# EAGLE design CCupPSU (EAGLE 6.5.0)
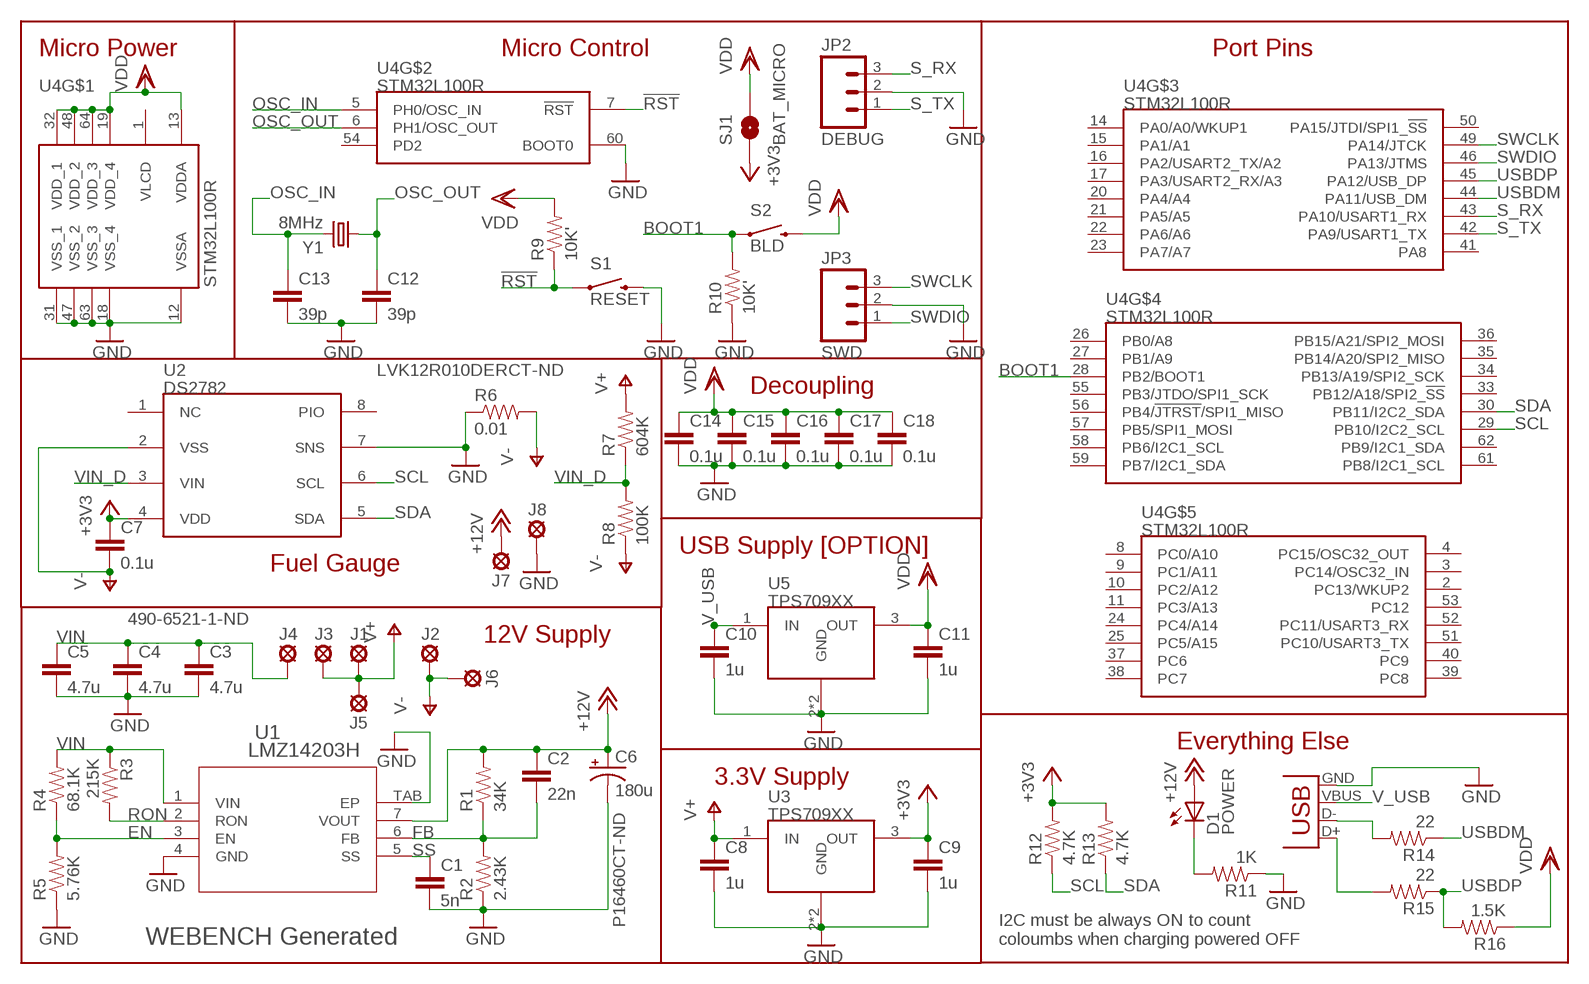
[diagram p0: schematic, sheet 1]

## Parts
C1  5n  CAP1206  [1206]
C2  22n  CAP1206  [1206]
C3  4.7u  CAP1206  [1206]
C4  4.7u  CAP1206  [1206]
C5  4.7u  CAP1206  [1206]
C6  180u  CAP_POLE  [PANASONIC_E]
C7  0.1u  CAP1206  [1206]
C8  1u  CAP1206  [1206]
C9  1u  CAP1206  [1206]
C10  1u  CAP1206  [1206]
C11  1u  CAP1206  [1206]
C12  39p  CAP1206  [1206]
C13  39p  CAP1206  [1206]
C14  0.1u  CAP1206  [1206]
C15  0.1u  CAP1206  [1206]
C16  0.1u  CAP1206  [1206]
C17  0.1u  CAP1206  [1206]
C18  0.1u  CAP1206  [1206]
D1  POWER  LED-RED1206  [LED-1206]
J1  SE14  [SE14]
J2  SE14  [SE14]
J3  SE14  [SE14]
J4  SE14  [SE14]
J5  SE14  [SE14]
J6  SE14  [SE14]
J7  SE14  [SE14]
J8  SE14  [SE14]
JP1  USBSMD  [USB-MINIB]
JP2  DEBUG  M03PTH  [1X03]
JP3  SWD  M03PTH  [1X03]
R1  34K  RESISTOR1206  [1206]
R2  2.43K  RESISTOR1206  [1206]
R3  215K  RESISTOR1206  [1206]
R4  68.1K  RESISTOR1206  [1206]
R5  5.76K  RESISTOR1206  [1206]
R6  0.01  RESISTOR1206  [1206]
R7  604K  RESISTOR1206  [1206]
R8  100K  RESISTOR1206  [1206]
R9  10K'  RESISTOR1206  [1206]
R10  10K'  RESISTOR1206  [1206]
R11  1K  RESISTOR1206  [1206]
R12  4.7K  RESISTOR1206  [1206]
R13  4.7K  RESISTOR1206  [1206]
R14  22  RES1206  [1206]
R15  22  RES1206  [1206]
R16  1.5K  RES1206  [1206]
S1  RESET  SWITCH-MOMENTARY-2PTH  [TACTILE-PTH]
S2  BLD  SWITCH-MOMENTARY-2PTH  [TACTILE-PTH]
SJ1  BAT_MICRO  SOLDERJUMPERTRACE  [SJ_2S-TRACE]
U1  LMZ14203H  [TZA07A]
U2  DS2782  [TSSOP8]
U3  TPS709XX  [SOT223]
U4  STM32L100R  [TQFP64]
U5  TPS709XX  [SOT223]
Y1  8MHz  CRYSTALHC49US  [HC49US]

## Nets
!RST!: R9.1 S1.1 U4.7(!RST!)
+3V3: C7.1 C9.1 R12.2 R13.2 SJ1.1 U2.4(VDD) U3.3(OUT)
+12V: C2.1 C6.+ D1.A J7.MP R1.2 U1.7(VOUT)
BOOT1: R10.2 S2.1 U4.28(PB2/BOOT1)
EN: R4.1 R5.2 U1.3(EN)
FB: C2.2 R1.1 R2.2 U1.6(FB)
GND: C1.2 C3.2 C4.2 C5.2 C6.- C8.2 C9.2 C10.2 C11.2 C12.2 C13.2 C14.2 C15.2 C16.2 C17.2 C18.2 J8.MP JP1.GND JP2.2 JP3.2 R2.1 R5.1 R6.1 R10.1 R11.1 S1.3 U1.4(GND) U1.TAB(EP) U2.7(SNS) U3.2(GND) U3.4(GND) U4.12(VSSA) U4.18(VSS_4) U4.31(VSS_1) U4.47(VSS_2) U4.60(BOOT0) U4.63(VSS_3) U5.2(GND) U5.4(GND)
OSC_IN: C13.1 U4.5(PH0/OSC_IN) Y1.2
OSC_OUT: C12.1 U4.6(PH1/OSC_OUT) Y1.1
PLED: D1.C R11.2
RON: R3.2 U1.2(RON)
S_RX: JP2.3 U4.43(PA10/USART1_RX)
S_TX: JP2.1 U4.42(PA9/USART1_TX)
SCL: R12.1 U2.6(SCL) U4.29(PB10/I2C2_SCL)
SDA: R13.1 U2.5(SDA) U4.30(PB11/I2C2_SDA)
SS: C1.1 U1.5(SS)
SWCLK: JP3.3 U4.49(PA14/JTCK)
SWDIO: JP3.1 U4.46(PA13/JTMS)
USB_D+: JP1.D+ R15.2
USB_D-: JP1.D- R14.2
USBDM: R14.1 U4.44(PA11/USB_DM)
USBDP: R15.1 R16.2 U4.45(PA12/USB_DP)
V+: C8.1 J1.MP J3.MP J5.MP R7.2 U3.1(IN)
V-: C7.2 J2.MP J6.MP R6.2 R8.1 U2.2(VSS)
V_USB: C10.1 JP1.VBUS U5.1(IN)
VDD: C11.1 C14.1 C15.1 C16.1 C17.1 C18.1 R9.2 R16.1 S2.3 SJ1.2 U4.13(VDDA) U4.19(VDD_4) U4.32(VDD_1) U4.48(VDD_2) U4.64(VDD_3) U5.3(OUT)
VIN: C3.1 C4.1 C5.1 J4.MP R3.1 R4.2 U1.1(VIN)
VIN_D: R7.1 R8.2 U2.3(VIN)
Unconnected: U2.1(NC) U2.8(PIO) U4.1(VLCD) U4.2(PC13/WKUP2) U4.3(PC14/OSC32_IN) U4.4(PC15/OSC32_OUT) U4.8(PC0/A10) U4.9(PC1/A11) U4.10(PC2/A12) U4.11(PC3/A13) U4.14(PA0/A0/WKUP1) U4.15(PA1/A1) U4.16(PA2/USART2_TX/A2) U4.17(PA3/USART2_RX/A3) U4.20(PA4/A4) U4.21(PA5/A5) U4.22(PA6/A6) U4.23(PA7/A7) U4.24(PC4/A14) U4.25(PC5/A15) U4.26(PB0/A8) U4.27(PB1/A9) U4.33(PB12/A18/SPI2_!SS!) U4.34(PB13/A19/SPI2_SCK) U4.35(PB14/A20/SPI2_MISO) U4.36(PB15/A21/SPI2_MOSI) U4.37(PC6) U4.38(PC7) U4.39(PC8) U4.40(PC9) U4.41(PA8) U4.50(PA15/JTDI/SPI1_!SS!) U4.51(PC10/USART3_TX) U4.52(PC11/USART3_RX) U4.53(PC12) U4.54(PD2) U4.55(PB3/JTDO/SPI1_SCK) U4.56(PB4/!JTRST!/SPI1_MISO) U4.57(PB5/SPI1_MOSI) U4.58(PB6/I2C1_SCL) U4.59(PB7/I2C1_SDA) U4.61(PB8/I2C1_SCL) U4.62(PB9/I2C1_SDA)

## Notes on the sheet
- Micro Power | Micro Control | Port Pins
- LVK12R010DERCT-ND
- Decoupling
- USB Supply [OPTION]
- Fuel Gauge
- 490-6521-1-ND
- 12V Supply
- Everything Else
- 3.3V Supply
- P16460CT-ND
- WEBENCH Generated
- I2C must be always ON to count
  coloumbs when charging powered OFF

## Library data of the parts
C1-C5 C7-C18 = SparkFun-Passives:CAP: Capacitor Standard 0603 ceramic capacitor, and 0.1" leaded capacitor.
C6 = SparkFun-Passives:CAP_POL: Capacitor Polarized These are standard SMD and PTH capacitors. Normally 10uF, 47uF, and 100uF in electrolytic and tantalum varieties. Always verify the external diameter of the through hole cap, it varies with capacity, voltage, and manufacturer. The EIA devices should be standard.
D1 = SparkFun-LED:LED-RED: Assorted Red LEDs LilyPad 1206- DIO-09912 1206- DIO-00809 0603- DIO-00819; PROD_ID: DIO-00809; VALUE: RED
J1-J8 = solpad:SE14: SOLDER PAD E1553, drill 1,4mm, distributor Buerklin, 07F820
JP1 = SparkFun-Connectors:USB: USB Connectors USB-B-PTH is fully proven SKU : PRT-00139/CONN-08278 USB-miniB is fully proven SKU : PRT-00587 USB-A-PCB is untested. USB-A-H is throughly reviewed, but untested. Spark Fun Electronics SKU : PRT-00437 USB-B-SMT is throughly reviewed, but untested. Needs silkscreen touching up. USB-A-S has not been used/tested USB-MB-H has not been used/tested USB-MICROB has been used. CONN-09505
JP2 JP3 = SparkFun-Connectors:M03: Header 3 Standard 3-pin 0.1" header. Use with straight break away headers (SKU : PRT-00116), right angle break away headers (PRT-00553), swiss pins (PRT-00743), machine pins (PRT-00117), and female headers (PRT-00115). Molex polarized connector foot print use with SKU : PRT-08232 with associated crimp pins and housings.
R1-R13 = SparkFun-Passives:RESISTOR: Resistor Basic schematic elements and footprints for 0603, 1206, and PTH resistors.
R14-R16 = ECE477:RES: RESISTOR Surface-mount resistors
S1 S2 = SparkFun-Electromechanical:SWITCH-MOMENTARY-2: Various NO switches- pushbuttons, reed, etc
SJ1 = SparkFun-Passives:SOLDERJUMPER: Solder Jumper Standard SMD solder jumper. Used to automate production. Two varients : Normally Open and Normally Closed are the same, but have different paste layers. NC will have a large amount of paste and should jumper during reflow.
U1 = CCupPSU:LMZ14203H: LMZ14203H 3A SIMPLE SWITCHER® Power Module with 42V Maximum Input; BASEPN: LMZ14203; DATASHEETURL: http://www.ti.com/lit/ds/symlink/lmz14203h.pdf; DESCRIPTION: 3A SIMPLE SWITCHER® Power Module with 42V Maximum Input; MANUFACTURER: Texas Instruments; MANUFACTURER_PART_NUMBER: lmz14203h_ndw_7; NSC_PACKAGEREFERENCE: TZA07A; VENDOR: Texas Instruments
U2 = LMZ14203H:DS2782: DS2782 Stand-Alone Fuel Gauge IC
U3 U5 = CCupPSU:TPS709XX: TPS709XX 150-mA, 30-V, Ultra-Low IQ, Wide Input Low-Dropout Regulator with Reverse Current Protection
U4 = CCupPSU:STM32L100R: STM32L100XX Ultra-low-power 32-bit Value Line ARM Cortex-M3 MCU with 32 Kbytes Flash, 32 MHz CPU, LCD, USB
Y1 = SparkFun-FreqCtrl:CRYSTAL: Various standard crystals. Proven footprints. Spark Fun Electronics SKU : COM-00534

## Board
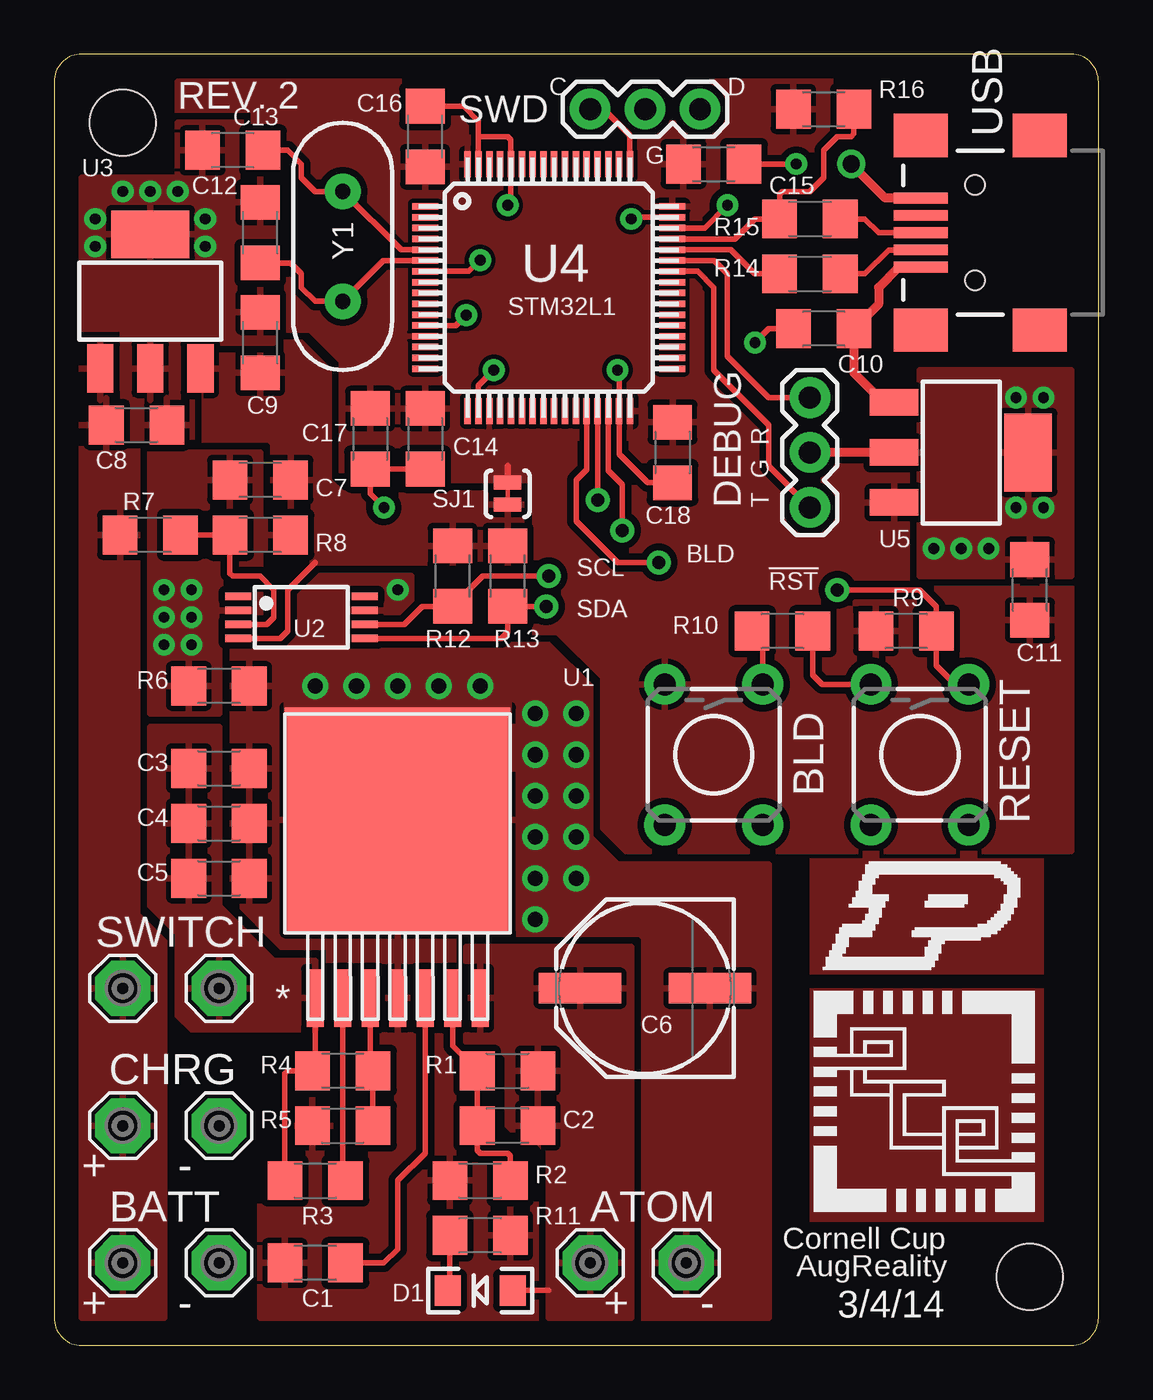
[diagram p1: board, top side]
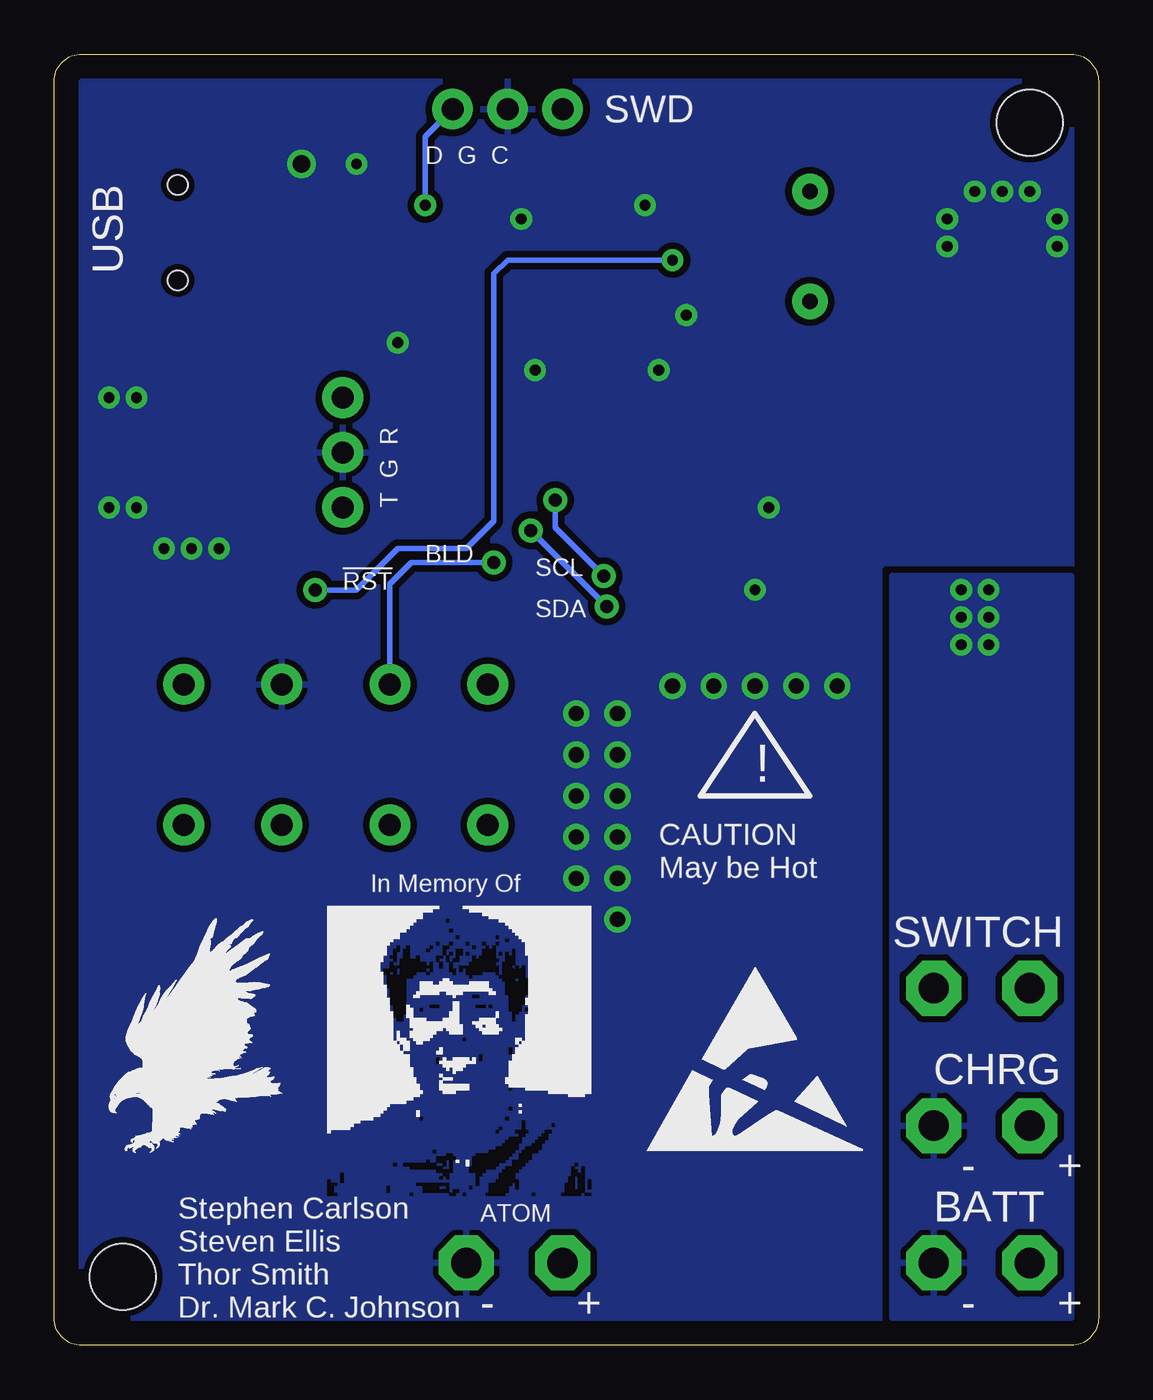
[diagram p2: board, bottom side, seen from below]

Size 48.26 x 59.69 mm. Coordinates in mm from the lower left corner, seen from the top.
Outline: 0,58.42 0,1.27 arc90 1.27,0 46.99,0 arc90 48.26,1.27 48.26,58.42 arc90 46.99,59.69 1.27,59.69 arc90 0,58.42
Copper layers (1*16): Top 0.035mm / dielectric 1.5mm / Bottom 0.035mm
Design rules "SparkFun *": minimum track width 8mil, minimum drill 13mil, track to track 8mil, track to pad 8mil, pad to pad 8mil, via to via 8mil, smd to smd 8mil, copper to edge 10mil, drill to drill 8mil, minimum pad ring 12mil, minimum via ring 10mil, stop-mask expansion 4mil, vias tented up to drill 25mil, thermal gap 10mil
Holes 3.05 mm at 45.09,3.17 3.17,56.52
bRestrict: area 35.2,6.9 to 35.6,7.1; area 31.7,6.9 to 31.8,7.1; area 29.7,6.9 to 30,7.1; area 29.2,6.9 to 29.4,7.1; area 27.4,6.9 to 28.3,7.1; area 26,6.9 to 26.2,7.1; area 23.9,6.9 to 24.8,7.1; area 23.4,6.9 to 23.7,7.1; area 35.3,7.1 to 35.6,7.2; area 32.7,7.1 to 32.9,7.2; area 30,7.1 to 31.2,7.2; area 29.5,7.1 to 29.8,7.2; 215 more areas

### Footprints (pad centres in the part's own frame; a part is rotated, then mirrored left to right if it is on the bottom)
1206 = smd 1.6 x 1.8: 1 -1.4,0; 2 1.4,0
PANASONIC_E = smd 3.8 x 1.4: + 3,0; - -3,0
LED-1206 = smd 1.2 x 1.4: A -1.5,0; C 1.5,0
SE14 = drill 1.397 pad 2.54 octagon: MP 0,0
USB-MINIB = smd 2.5 x 0.5: D+ 2.5,0; D- 2.5,0.8; GND 2.5,-1.6; ID 2.5,-0.8; VBUS 2.5,1.6 | smd 2.5 x 2: MTN1 -3,4.5; MTN2 2.5,4.5; MTN3 -3,-4.5; MTN4 2.5,-4.5 | hole 0.9: 0,2.2; 0,-2.2
1X03 = drill 1.016 pad 1.88: 1 0,0; 2 2.54,0; 3 5.08,0
TACTILE-PTH = drill 1.016 pad 1.88: 1 -3.251,2.261; 2 3.251,2.261; 3 -3.251,-2.261; 4 3.251,-2.261
SJ_2S-TRACE = smd 0.635 x 1.27: 1 -0.508,0; 2 0.508,0
TZA07A = smd 0.787 x 2.667: 1 -3.81,-8.077; 2 -2.54,-8.077; 3 -1.27,-8.077; 4 0,-8.077; 5 1.27,-8.077; 6 2.54,-8.077; 7 3.81,-8.077 | smd 10.414 x 10.414: TAB 0,0.152
TSSOP8 = smd 1.2 x 0.35: 1 -2.925,0.975; 2 -2.925,0.325; 3 -2.925,-0.325; 4 -2.925,-0.975; 5 2.925,-0.975; 6 2.925,-0.325; 7 2.925,0.325; 8 2.925,0.975
SOT223 = smd 1.219 x 2.235: 1 -2.311,-3.099; 2 0,-3.099; 3 2.311,-3.099 | smd 3.6 x 2.2: 4 0,3.099
TQFP64 = smd 1.2 x 0.3: 1 -5.7,3.75; 2 -5.7,3.25; 3 -5.7,2.75; 4 -5.7,2.25; 5 -5.7,1.75; 6 -5.7,1.25; 7 -5.7,0.75; 8 -5.7,0.25; 9 -5.7,-0.25; 10 -5.7,-0.75; 11 -5.7,-1.25; 12 -5.7,-1.75; 13 -5.7,-2.25; 14 -5.7,-2.75; 15 -5.7,-3.25; 16 -5.7,-3.75; 33 5.7,-3.75; 34 5.7,-3.25; 35 5.7,-2.75; 36 5.7,-2.25; 37 5.7,-1.75; 38 5.7,-1.25; 39 5.7,-0.75; 40 5.7,-0.25; 41 5.7,0.25; 42 5.7,0.75; 43 5.7,1.25; 44 5.7,1.75; 45 5.7,2.25; 46 5.7,2.75; 47 5.7,3.25; 48 5.7,3.75 | smd 0.3 x 1.2: 17 -3.75,-5.7; 18 -3.25,-5.7; 19 -2.75,-5.7; 20 -2.25,-5.7; 21 -1.75,-5.7; 22 -1.25,-5.7; 23 -0.75,-5.7; 24 -0.25,-5.7; 25 0.25,-5.7; 26 0.75,-5.7; 27 1.25,-5.7; 28 1.75,-5.7; 29 2.25,-5.7; 30 2.75,-5.7; 31 3.25,-5.7; 32 3.75,-5.7; 49 3.75,5.7; 50 3.25,5.7; 51 2.75,5.7; 52 2.25,5.7; 53 1.75,5.7; 54 1.25,5.7; 55 0.75,5.7; 56 0.25,5.7; 57 -0.25,5.7; 58 -0.75,5.7; 59 -1.25,5.7; 60 -1.75,5.7; 61 -2.25,5.7; 62 -2.75,5.7; 63 -3.25,5.7; 64 -3.75,5.7
HC49US = drill 0.7 pad 1.651: 1 -2.54,0; 2 2.54,0

### Placement (x,y rotation side)
C1  12.06,3.81 180 top
C2  20.95,10.16 180 top
C3  7.62,26.67 0 top
C4  7.62,24.13 0 top
C5  7.62,21.59 0 top
C6  27.3,16.51 180 top
C7  9.53,40.01 180 top
C8  3.81,42.55 0 top
C9  9.53,46.35 90 top
C10  35.56,46.99 180 top
C11  45.09,34.92 90 top
C12  9.53,51.44 90 top
C13  8.26,55.24 180 top
C14  17.14,41.91 270 top
C15  30.48,54.61 0 top
C16  17.14,55.88 90 top
C17  14.61,41.91 270 top
C18  28.57,41.27 270 top
D1  19.68,2.54 180 top
J1  3.17,3.81 0 top
J2  7.62,3.81 0 top
J3  3.17,16.51 0 top
J4  7.62,16.51 0 top
J5  3.17,10.16 0 top
J6  7.62,10.16 0 top
J7  24.77,3.81 0 top
J8  29.21,3.81 0 top
JP1  42.55,51.44 180 top
JP2  34.92,38.73 90 top
JP3  29.84,57.15 180 top
R1  20.95,12.7 0 top
R2  19.68,7.62 0 top
R3  12.06,7.62 0 top
R4  13.34,12.7 180 top
R5  13.34,10.16 0 top
R6  7.62,30.48 180 top
R7  4.45,37.47 180 top
R8  9.53,37.47 180 top
R9  39.37,33.02 180 top
R10  33.66,33.02 180 top
R11  19.68,5.08 180 top
R12  18.41,35.56 90 top
R13  20.95,35.56 90 top
R14  34.92,49.53 0 top
R15  34.92,52.07 0 top
R16  35.56,57.15 0 top
S1  40.01,27.3 270 top
S2  30.48,27.3 270 top
SJ1  20.95,39.37 90 top
U1  15.88,24.13 0 top
U2  11.43,33.66 0 top
U3  4.45,48.26 0 top
U4  22.86,48.9 0 top
U5  41.91,41.27 270 top
U$1  [ESD_10.00]  20.95,8.89 0 bottom
U$2  [EAGLE-PLC-8MM]  45.72,8.89 0 bottom
Y1  13.34,50.8 90 top

### Tracks (layer width: path | path; a pad name or v marks a point on that pad's centre or on a via)
!RST!  (via drill 0.5, 0.6)
  Top 0.254: U4.7 19.16,49.65 v19.68,50.16 | v36.2,34.92 40.01,34.92 40.77,34.16 R9.1 40.77,31.42 41.63,30.56 S1.1
  Bottom 0.254: v19.68,50.16 27.3,50.16 27.94,49.53 27.94,38.1 29.21,36.83 32.38,36.83 34.29,34.92 v36.2,34.92
+3V3
  Top 0.254: U2.4 10.46,32.68 10.79,33.02 10.79,34.92 12.06,36.2
  pour Top (isolate 0.305, rank 2): 6.35,46.35 6.35,41.27 9.53,41.27 9.53,36.83 10.16,36.2 21.59,36.2 21.59,39.37 13.34,39.37 12.7,40.01 12.7,45.09 11.43,46.35
+12V
  Top 0.254: D1.A 22.86,2.54
  pour Top (isolate 0.305): 19.05,13.97 20.32,13.97 20.95,13.34 20.95,10.16 21.59,9.53 22.23,9.53 22.86,8.89 22.86,1.27 26.67,1.27 26.67,18.41 19.05,18.41
BOOT1  (via drill 0.6)
  Top 0.254: S2.1 32.74,32.53 R10.2 | U4.28 24.61,40.48 24.13,40.01 24.13,38.1 26.04,36.2 v27.94,36.2
  Bottom 0.254: v27.94,36.2 31.75,36.2 32.74,35.2 S2.1
EN
  Top 0.254: U1.3 14.61,12.83 R4.1 R5.2
FB
  Top 0.254: R2.2 21.09,8.76 20.95,8.89 19.68,8.89 19.55,9.02 C2.2 R1.1 18.41,13.84 U1.6
  Top 0.305: 19.68,12.83 R1.1
GND  (via drill 0.5, 0.7, 0.8)
  Top 0.254: C14.2 C17.2 14.61,39.37 v15.24,38.73 | R10.1 35.05,30.98 35.48,30.56 S1.3 | U4.63 19.61,55.88 | 19.61,55.88 19.61,56.59 18.92,57.28 C16.2 | 19.61,55.88 20.95,55.88 21.11,55.73 U4.60 21.11,52.86 v20.95,52.7 | U4.12 18.57,47.15 v19.05,47.62 | U4.18 19.61,44.38 v20.32,45.09 | U4.47 26.75,52.15 v26.67,52.07 | C18.2 27.43,39.88 26.11,41.2 U4.31 26.11,45.01 v26.04,45.09 | C10.2 33.02,46.99 v32.38,46.35 | C15.2 v34.29,54.61
  Top 0.406: JP1.GND 38.41,53.03 v36.83,54.61 | U5.2 JP2.2
  other vias: 12.06,30.48 13.97,30.48 15.88,30.48 17.78,30.48 19.68,30.48 22.23,23.5 22.23,21.59 24.13,23.5 22.23,19.68 24.13,25.4 24.13,29.21 22.23,25.4 22.23,27.3 22.23,29.21 24.13,27.3 24.13,21.59 1.91,50.8 6.99,50.8 6.99,52.07 1.91,52.07 3.17,53.34 4.45,53.34 5.71,53.34 15.88,34.92 44.45,38.73 45.72,38.73 44.45,43.81 45.72,43.81 40.64,36.83 41.91,36.83 43.18,36.83
  pour Bottom (isolate 0.305, rank 3): 1.27,58.42 1.27,1.27 46.99,1.27 46.99,58.42
  pour Top (isolate 0.305, rank 3): 8.26,32.38 8.26,20.32 10.16,18.41 12.7,18.41 12.7,13.97 9.53,13.97 9.53,1.27 33.02,1.27 33.02,22.23 26.04,22.23 24.77,23.5 24.77,30.48 22.86,32.38 16.51,32.38 16.51,35.56 10.79,35.56 10.79,33.02 10.16,32.38
  pour Top (isolate 0.305, no thermals): 21.59,26.67 10.79,26.67 10.79,28.57 21.59,28.57
  pour Top (isolate 0.305): 1.27,53.98 1.27,46.99 3.17,46.99 3.17,41.91 6.35,41.91 6.35,46.35 10.16,46.35 10.16,56.52 5.71,56.52 5.71,53.98
  pour Top (isolate 0.305, no thermals): 10.79,30.48 10.79,29.21 20.95,29.21 20.95,30.48
  pour Top (isolate 0.305, rank 3): 40.01,45.09 40.01,35.56 46.99,35.56 46.99,45.09
  pour Bottom (no thermals): 22.86,20.32 22.86,6.35 36.2,6.35 36.2,20.32
  pour Top (rank 5, no thermals): 34.92,22.86 34.92,17.14 45.72,17.14 45.72,22.86
  pour Top (rank 5, no thermals): 34.92,16.51 34.92,5.71 45.72,5.71 45.72,16.51
OSC_IN
  Top 0.254: U4.5 16.03,50.65 Y1.2 12.06,53.34 11.43,53.98 11.43,54.61 10.79,55.24 C13.1
OSC_OUT
  Top 0.254: U4.6 15.22,50.15 Y1.1 12.06,48.26 11.43,48.9 11.43,49.53 10.93,50.03 C12.1
PLED
  Top 0.254: R11.2 18.29,2.64
  Top 0.305: 18.29,2.64 D1.C
RON
  Top 0.254: U1.2 13.34,7.75 R3.2
S_RX
  Top 0.254: U4.43 30.5,50.15 31.11,49.53 31.11,45.72 33.02,43.81 JP2.3
S_TX
  Top 0.254: U4.42 29.73,49.65 30.48,48.9 30.48,45.09 33.02,42.55 33.02,40.64 JP2.1
SCL  (via drill 0.6)
  Top 0.254: U2.6 16.18,33.33 17.02,34.16 R12.1 19.82,35.56 v22.86,35.56 | U4.29 v25.11,39.08
  Bottom 0.254: v25.11,39.08 25.11,37.81 v22.86,35.56
SDA  (via drill 0.6)
  Top 0.254: U2.5 20.66,32.68 20.95,32.98 R13.1 v22.73,34.16 | v26.25,37.67 26.25,39.8 25.61,40.43 U4.30
  Bottom 0.254: v22.73,34.16 v26.25,37.67
SS
  Top 0.254: U1.5 17.14,8.89 15.88,7.62 15.88,4.45 15.24,3.81 C1.1
SWCLK
  Top 0.254: U4.49 26.61,55.94 25.4,57.15 JP3.3
SWDIO  (via drill 0.5)
  Top 0.254: U4.46 30.05,51.65 v31.11,52.7
  Bottom 0.254: v31.11,52.7 31.11,55.88 JP3.1
USB_D+
  Top 0.254: JP1.D+ 38.1,51.44 37.47,52.07 R15.2
USB_D-
  Top 0.254: R14.2 37.47,49.53 38.57,50.63 JP1.D-
USBDM
  Top 0.254: U4.44 31.27,50.65 32.38,49.53 R14.1
USBDP
  Top 0.254: U4.45 31.46,51.15 32.38,52.07 R15.1 33.52,53.21 33.66,53.34 34.92,53.34 35.56,53.98 35.56,55.24 36.2,55.88 36.83,55.88 36.96,56.01 R16.2
V+
  pour Top (isolate 0.305, rank 2): 1.27,1.27 5.08,1.27 5.08,19.05 4.45,19.68 4.45,46.35 1.27,46.35
V-  (via drill 0.5)
  other vias: 6.35,33.66 5.08,32.38 6.35,32.38 5.08,33.66 5.08,34.92 6.35,34.92
  pour Bottom (isolate 0.305): 1.27,35.56 1.27,1.27 9.53,1.27 9.53,35.56
  pour Top (isolate 0.305): 4.45,41.27 4.45,29.21 7.62,29.21 7.62,33.02 8.89,33.02 9.53,33.66 9.53,36.83 11.43,36.83 11.43,38.1 9.53,38.1 9.53,41.27
V_USB
  Top 0.406: U5.1 38.33,43.59 36.96,44.95 C10.1 38.1,48.13 38.1,48.9 39.04,49.84 JP1.VBUS
VDD
  Top 0.305: SJ1.2 20.95,40.64
  pour Top (isolate 0.305, rank 4): 5.71,58.42 5.71,54.61 8.89,54.61 8.89,40.01 22.23,40.01 22.23,22.86 46.99,22.86 46.99,58.42
  pour Top (isolate 0.203, rank 3): 18.41,55.88 15.88,53.34 15.88,44.45 18.41,41.91 27.3,41.91 29.84,44.45 29.84,53.34 27.3,55.88
  pour Top (rank 2, no thermals): 19.68,40.64 19.68,40.01 22.23,40.01 22.23,40.64
VIN
  Top 0.254: U1.1 12.06,12.83 R4.2 10.79,12.7 10.66,12.57 R3.1
  pour Top (isolate 0.305): 4.45,28.57 4.45,20.32 5.71,19.05 5.71,15.24 6.35,14.61 12.06,14.61 12.06,17.78 10.16,17.78 7.62,20.32 7.62,28.57
VIN_D
  Top 0.254: U2.3 9.84,33.33 10.16,33.66 10.16,34.92 9.53,35.56 8.26,35.56 8.12,35.69 R8.2 R7.1

### Text on the board
tPlace: C | D | REV. 2 | USB | G | STM32L1 | T G R | SCL | BLD | !RST! | SDA | U1 | BLD | RESET | SWITCH | CHRG | + | - | BATT | ATOM | Cornell Cup | AugReality | + | - | + | - | 3/4/14
bPlace: SWD | D G C | USB | T G R | SCL | BLD | !RST! | SDA | ! | CAUTION / May be Hot | In Memory Of | SWITCH | CHRG | + | - | BATT | ATOM | + | - | + | - | Stephen Carlson / Steven Ellis / Thor Smith / Dr. Mark C. Johnson